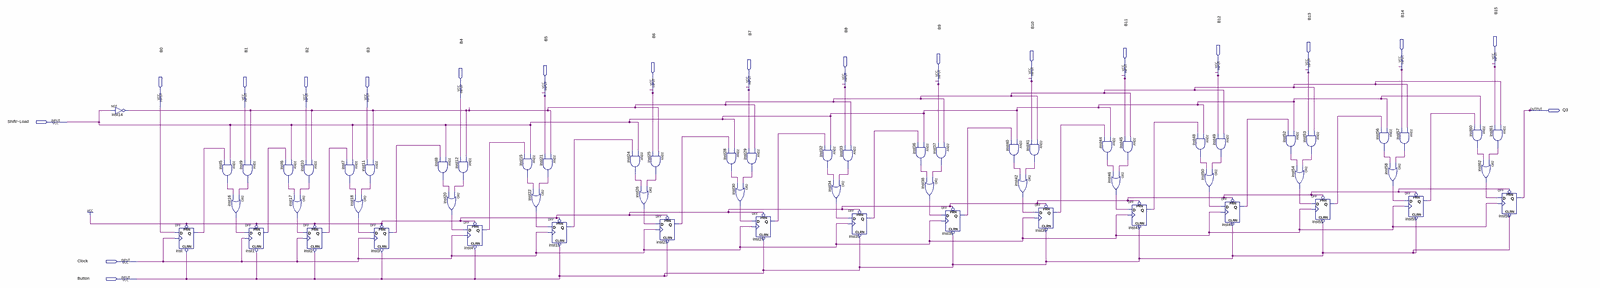
[diagram p0: schematic sheet, whole]
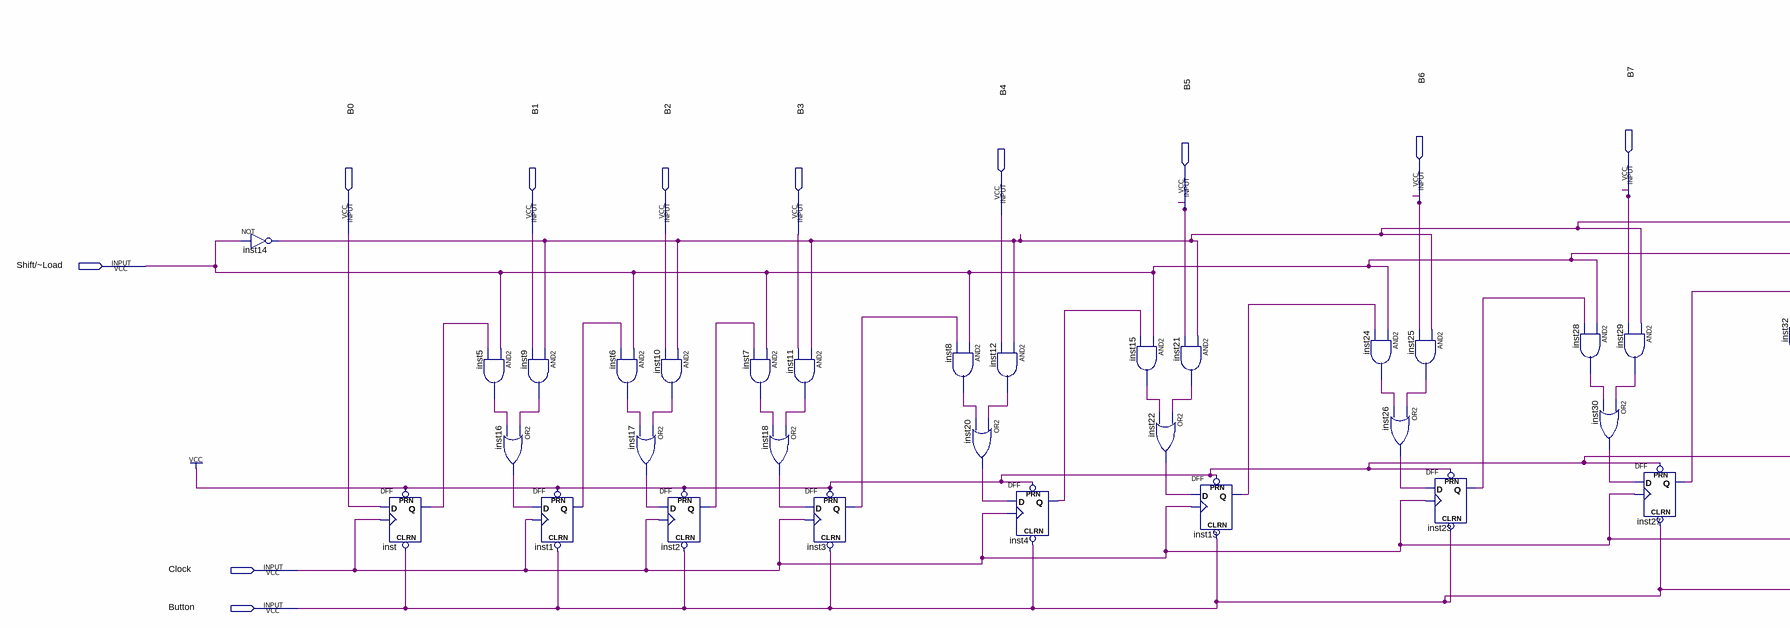
[diagram p1: schematic sheet, left part]
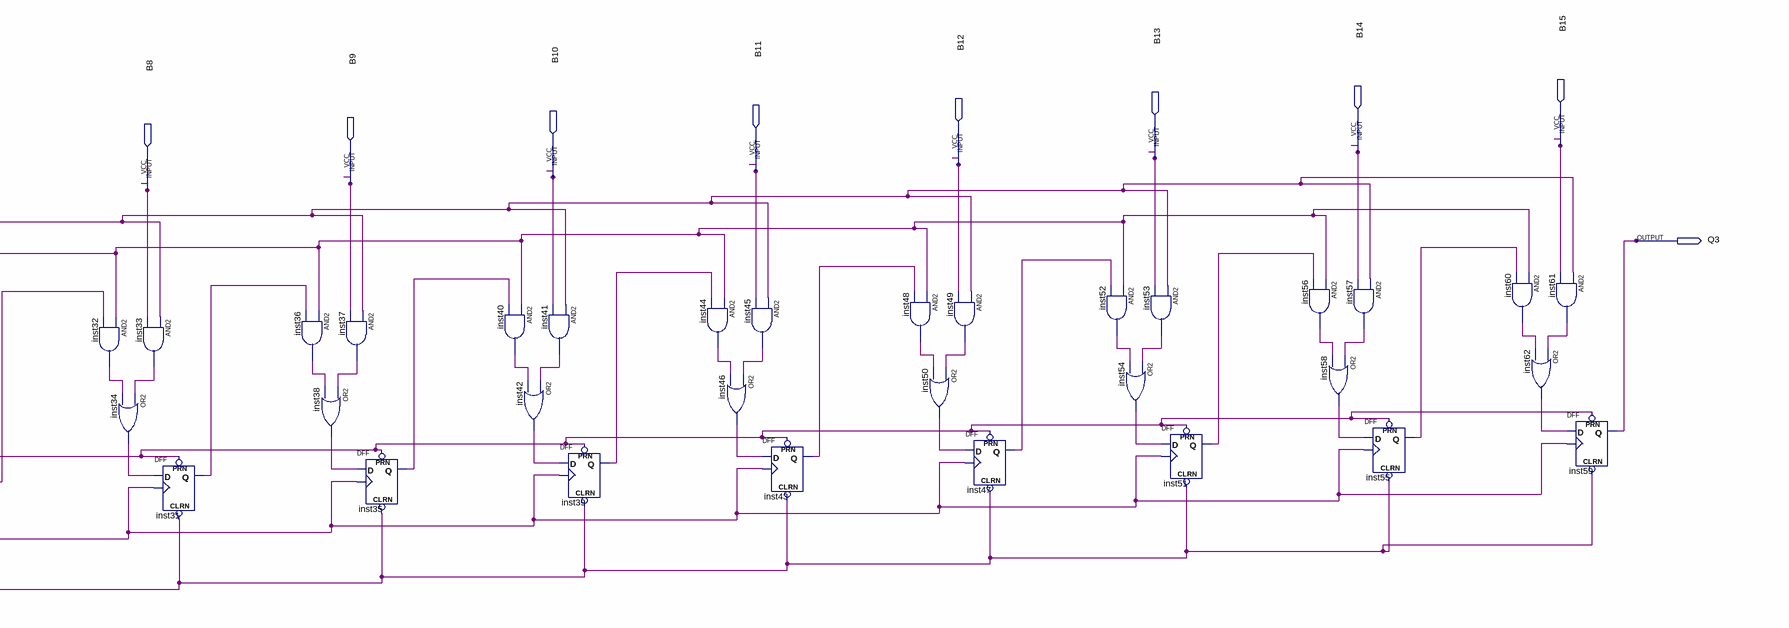
[diagram p2: schematic sheet, right part]
// Quartus schematic shift_register_16bit.bdf as structural Verilog: 62 symbols, 20 pins
module shift_register_16bit (
  input  B15,
  input  B14,
  input  B13,
  input  B12,
  input  B11,
  input  B10,
  input  B9,
  input  B8,
  input  B7,
  input  B6,
  input  B5,
  input  B4,
  input  B0,
  input  B1,
  input  B2,
  input  B3,
  input  \Shift/~Load ,
  input  Clock,
  input  Button,
  output Q3
);

  wire inst1_q, inst2_q, inst3_q, inst4_q, inst5_out, inst6_out, inst7_out, inst8_out, inst9_out, inst10_out,
       inst11_out, inst12_out, inst13_q, inst14_out, inst15_out, inst16_out, inst17_out, inst18_out,
       inst20_out, inst21_out, inst22_out, inst23_q, inst24_out, inst25_out, inst26_out, inst27_q,
       inst28_out, inst29_out, inst30_out, inst31_q, inst32_out, inst33_out, inst34_out, inst35_q,
       inst36_out, inst37_out, inst38_out, inst39_q, inst40_out, inst41_out, inst42_out, inst43_q,
       inst44_out, inst45_out, inst46_out, inst47_q, inst48_out, inst49_out, inst50_out, inst51_q,
       inst52_out, inst53_out, inst54_out, inst55_q, inst56_out, inst57_out, inst58_out, inst60_out,
       inst61_out, inst62_out, inst_q;

  not inst14 (inst14_out, \Shift/~Load );
  DFF inst (.CLRN(Button), .CLK(Clock), .D(B0), .PRN(1'b1), .Q(inst_q));
  and inst5 (inst5_out, \Shift/~Load , inst_q);
  and inst9 (inst9_out, inst14_out, B1);
  or inst16 (inst16_out, inst9_out, inst5_out);
  DFF inst1 (.CLRN(Button), .CLK(Clock), .D(inst16_out), .PRN(1'b1), .Q(inst1_q));
  and inst6 (inst6_out, \Shift/~Load , inst1_q);
  or inst17 (inst17_out, inst10_out, inst6_out);
  and inst10 (inst10_out, inst14_out, B2);
  DFF inst2 (.CLRN(Button), .CLK(Clock), .D(inst17_out), .PRN(1'b1), .Q(inst2_q));
  and inst7 (inst7_out, \Shift/~Load , inst2_q);
  and inst11 (inst11_out, inst14_out, B3);
  or inst18 (inst18_out, inst11_out, inst7_out);
  DFF inst3 (.CLRN(Button), .CLK(Clock), .D(inst18_out), .PRN(1'b1), .Q(inst3_q));
  and inst8 (inst8_out, \Shift/~Load , inst3_q);
  and inst12 (inst12_out, inst14_out, B4);
  or inst20 (inst20_out, inst12_out, inst8_out);
  DFF inst4 (.CLRN(Button), .CLK(Clock), .D(inst20_out), .PRN(1'b1), .Q(inst4_q));
  and inst15 (inst15_out, \Shift/~Load , inst4_q);
  or inst22 (inst22_out, inst21_out, inst15_out);
  and inst21 (inst21_out, inst14_out, B5);
  DFF inst13 (.CLRN(Button), .CLK(Clock), .D(inst22_out), .PRN(1'b1), .Q(inst13_q));
  and inst24 (inst24_out, \Shift/~Load , inst13_q);
  or inst26 (inst26_out, inst25_out, inst24_out);
  and inst25 (inst25_out, inst14_out, B6);
  DFF inst23 (.CLRN(Button), .CLK(Clock), .D(inst26_out), .PRN(1'b1), .Q(inst23_q));
  and inst28 (inst28_out, \Shift/~Load , inst23_q);
  or inst30 (inst30_out, inst29_out, inst28_out);
  and inst29 (inst29_out, inst14_out, B7);
  DFF inst27 (.CLRN(Button), .CLK(Clock), .D(inst30_out), .PRN(1'b1), .Q(inst27_q));
  and inst32 (inst32_out, \Shift/~Load , inst27_q);
  or inst34 (inst34_out, inst33_out, inst32_out);
  and inst33 (inst33_out, inst14_out, B8);
  DFF inst31 (.CLRN(Button), .CLK(Clock), .D(inst34_out), .PRN(1'b1), .Q(inst31_q));
  and inst36 (inst36_out, \Shift/~Load , inst31_q);
  or inst38 (inst38_out, inst37_out, inst36_out);
  and inst37 (inst37_out, inst14_out, B9);
  DFF inst35 (.CLRN(Button), .CLK(Clock), .D(inst38_out), .PRN(1'b1), .Q(inst35_q));
  and inst40 (inst40_out, \Shift/~Load , inst35_q);
  or inst42 (inst42_out, inst41_out, inst40_out);
  and inst41 (inst41_out, inst14_out, B10);
  DFF inst39 (.CLRN(Button), .CLK(Clock), .D(inst42_out), .PRN(1'b1), .Q(inst39_q));
  and inst44 (inst44_out, \Shift/~Load , inst39_q);
  or inst46 (inst46_out, inst45_out, inst44_out);
  and inst45 (inst45_out, inst14_out, B11);
  DFF inst43 (.CLRN(Button), .CLK(Clock), .D(inst46_out), .PRN(1'b1), .Q(inst43_q));
  and inst48 (inst48_out, \Shift/~Load , inst43_q);
  or inst50 (inst50_out, inst49_out, inst48_out);
  and inst49 (inst49_out, inst14_out, B12);
  DFF inst47 (.CLRN(Button), .CLK(Clock), .D(inst50_out), .PRN(1'b1), .Q(inst47_q));
  and inst52 (inst52_out, \Shift/~Load , inst47_q);
  or inst54 (inst54_out, inst53_out, inst52_out);
  and inst53 (inst53_out, inst14_out, B13);
  DFF inst51 (.CLRN(Button), .CLK(Clock), .D(inst54_out), .PRN(1'b1), .Q(inst51_q));
  and inst56 (inst56_out, \Shift/~Load , inst51_q);
  or inst58 (inst58_out, inst57_out, inst56_out);
  and inst57 (inst57_out, inst14_out, B14);
  DFF inst55 (.CLRN(Button), .CLK(Clock), .D(inst58_out), .PRN(1'b1), .Q(inst55_q));
  and inst60 (inst60_out, \Shift/~Load , inst55_q);
  or inst62 (inst62_out, inst61_out, inst60_out);
  and inst61 (inst61_out, inst14_out, B15);
  DFF inst59 (.CLRN(Button), .CLK(Clock), .D(inst62_out), .PRN(1'b1), .Q(Q3));
endmodule
